# EAGLE schematic snc98_Display_15x7-Seg_1-digit_SC39 (EAGLE 6.6.0)

## Sheet 1 of 2
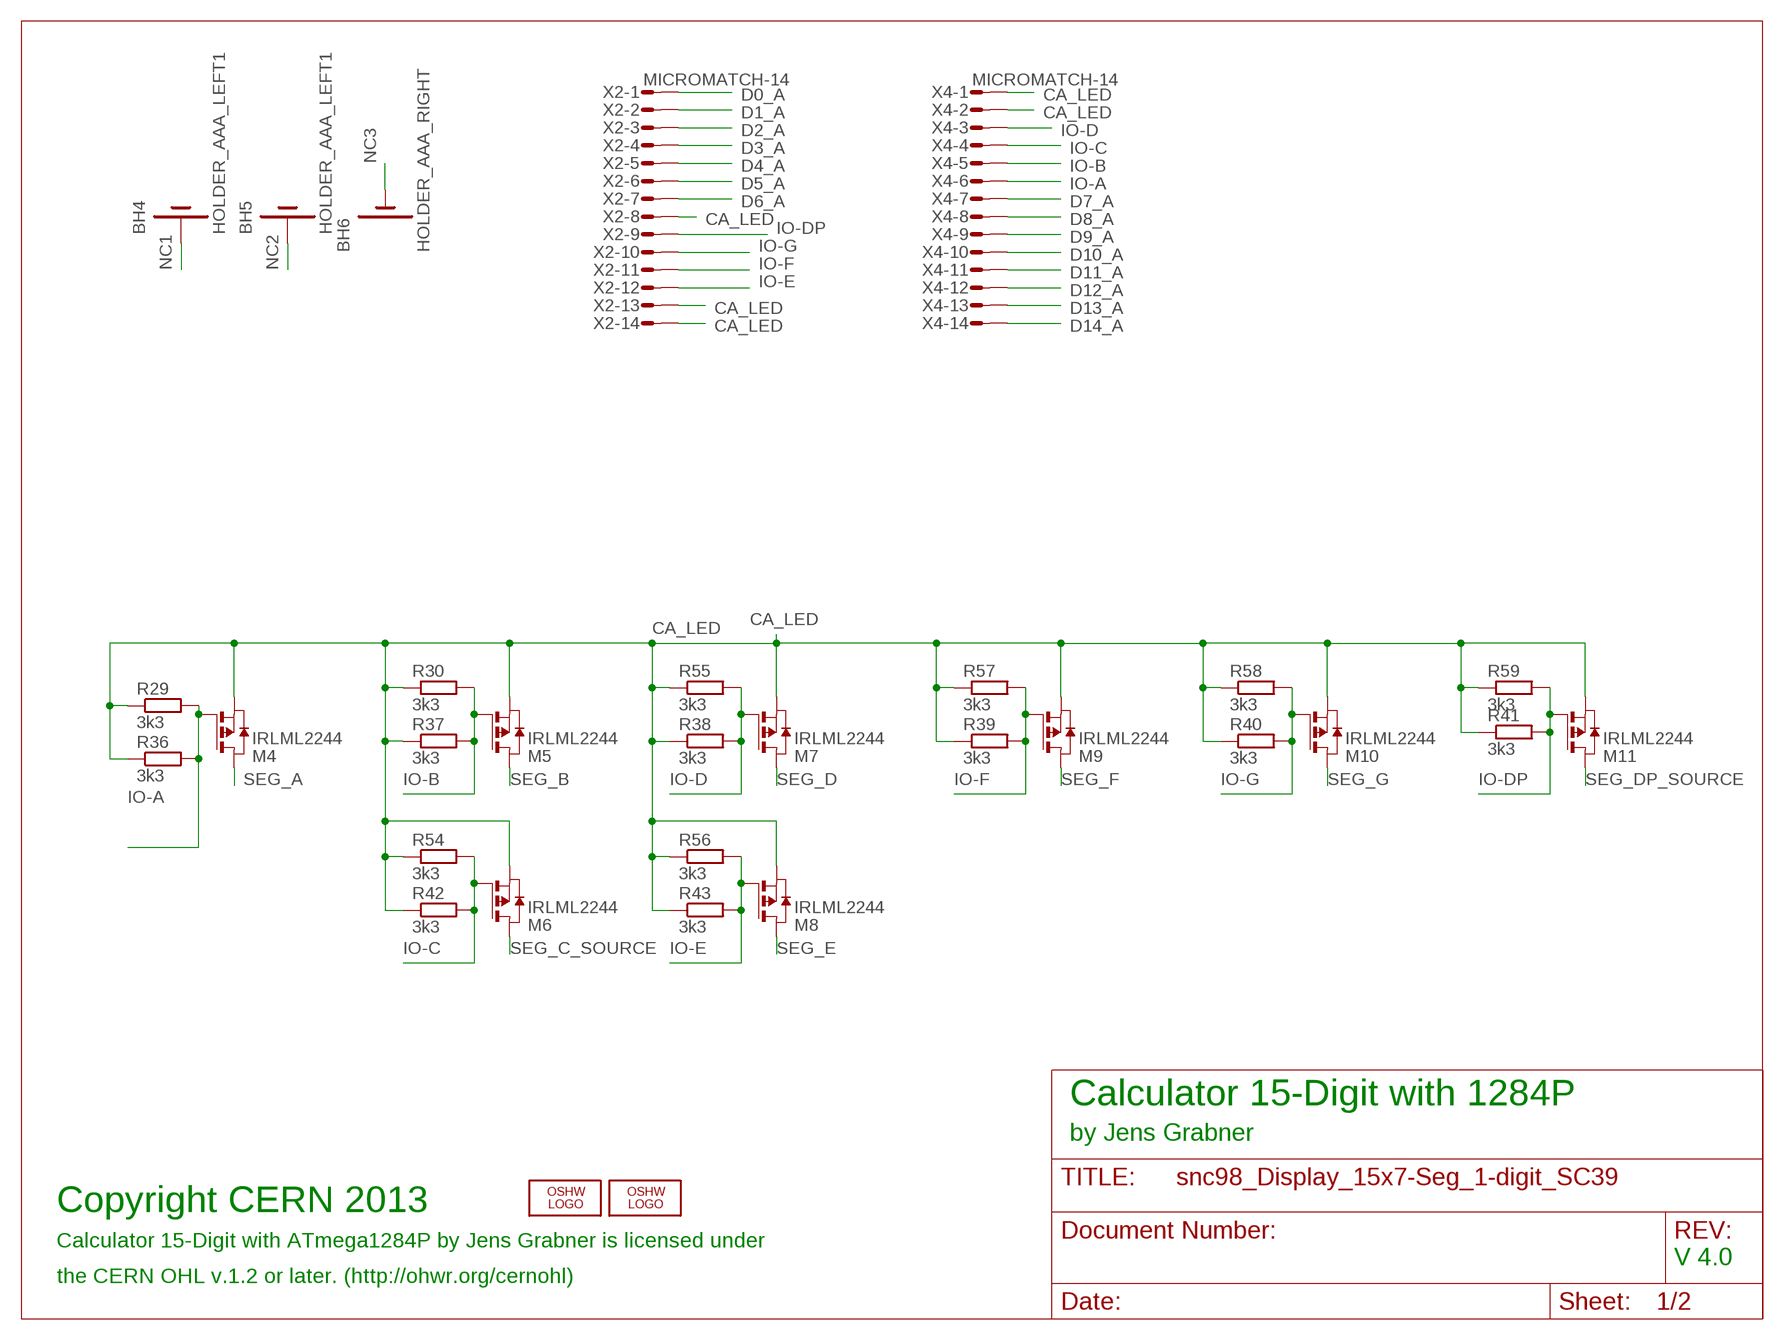
[diagram p0: schematic, sheet 1]

### Parts
BH4  HOLDER_AAA_LEFT1  [BATTERY-AAA-LEFT]
BH5  HOLDER_AAA_LEFT1  [BATTERY-AAA-LEFT]
BH6  HOLDER_AAA_RIGHT  [BATTERY-AAA-RIGHT]
LOGO1  OSHW_LOGO_8MILX0150-NT  [OSHW_8X150_NOTEXT]
LOGO3  OSHW_LOGO_6MILX0100-NT  [OSHW_6X100_NOTEXT]
M4  IRLML2244  IRLML6402  [SOT-23]
M5  IRLML2244  IRLML6402  [SOT-23]
M6  IRLML2244  IRLML6402  [SOT-23]
M7  IRLML2244  IRLML6402  [SOT-23]
M8  IRLML2244  IRLML6402  [SOT-23]
M9  IRLML2244  IRLML6402  [SOT-23]
M10  IRLML2244  IRLML6402  [SOT-23]
M11  IRLML2244  IRLML6402  [SOT-23]
R29  3k3  R-EU_0204/5  [0204/5]
R30  3k3  R-EU_0204/5  [0204/5]
R36  3k3  R-EU_R1206  [R1206]
R37  3k3  R-EU_R1206  [R1206]
R38  3k3  R-EU_R1206  [R1206]
R39  3k3  R-EU_R1206  [R1206]
R40  3k3  R-EU_R1206  [R1206]
R41  3k3  R-EU_R1206  [R1206]
R42  3k3  R-EU_R1206  [R1206]
R43  3k3  R-EU_R1206  [R1206]
R54  3k3  R-EU_0204/5  [0204/5]
R55  3k3  R-EU_0204/5  [0204/5]
R56  3k3  R-EU_0204/5  [0204/5]
R57  3k3  R-EU_0204/5  [0204/5]
R58  3k3  R-EU_0204/5  [0204/5]
R59  3k3  R-EU_0204/5  [0204/5]
X2  MICROMATCH-14  [MICROMATCH-14]
X4  MICROMATCH-14  [MICROMATCH-14]

### Nets
CA_LED: M4.2(S) M5.2(S) M6.2(S) M7.2(S) M8.2(S) M9.2(S) M10.2(S) M11.2(S) R29.1 R30.1 R36.1 R37.1 R38.1 R39.1 R40.1 R41.1 R42.1 R43.1 R54.1 R55.1 R56.1 R57.1 R58.1 R59.1 X2.8 X2.13 X2.14 X4.1 X4.2 ; also sheet 2
D0_A: X2.1 ; also sheet 2
D1_A: X2.2 ; also sheet 2
D2_A: X2.3 ; also sheet 2
D3_A: X2.4 ; also sheet 2
D4_A: X2.5 ; also sheet 2
D5_A: X2.6 ; also sheet 2
D6_A: X2.7 ; also sheet 2
D7_A: X4.7 ; also sheet 2
D8_A: X4.8 ; also sheet 2
D9_A: X4.9 ; also sheet 2
D10_A: X4.10 ; also sheet 2
D11_A: X4.11 ; also sheet 2
D12_A: X4.12 ; also sheet 2
D13_A: X4.13 ; also sheet 2
D14_A: X4.14 ; also sheet 2
IO-A: M4.1(G) R29.2 R36.2 X4.6 ; also sheet 2
IO-B: M5.1(G) R30.2 R37.2 X4.5 ; also sheet 2
IO-C: M6.1(G) R42.2 R54.2 X4.4 ; also sheet 2
IO-D: M7.1(G) R38.2 R55.2 X4.3 ; also sheet 2
IO-DP: M11.1(G) R41.2 R59.2 X2.9 ; also sheet 2
IO-E: M8.1(G) R43.2 R56.2 X2.12 ; also sheet 2
IO-F: M9.1(G) R39.2 R57.2 X2.11 ; also sheet 2
IO-G: M10.1(G) R40.2 R58.2 X2.10 ; also sheet 2
NC1: BH4.P1(+) BH4.P2(+) BH4.P3(+) BH4.P4(+)
NC2: BH5.P1(+) BH5.P2(+) BH5.P3(+) BH5.P4(+)
NC3: BH6.M1(-) BH6.M2(-) BH6.M3(-) BH6.M4(-)
SEG_A: M4.3(D) ; also sheet 2
SEG_B: M5.3(D) ; also sheet 2
SEG_C_SOURCE: M6.3(D) ; also sheet 2
SEG_D: M7.3(D) ; also sheet 2
SEG_DP_SOURCE: M11.3(D) ; also sheet 2
SEG_E: M8.3(D) ; also sheet 2
SEG_F: M9.3(D) ; also sheet 2
SEG_G: M10.3(D) ; also sheet 2

### Notes on the sheet
- Calculator 15-Digit with 1284P
- by Jens Grabner
- Copyright CERN 2013
- Calculator 15-Digit with ATmega1284P by Jens Grabner is licensed under
- V 4.0
- the CERN OHL v.1.2 or later. (http://ohwr.org/cernohl)

## Sheet 2 of 2
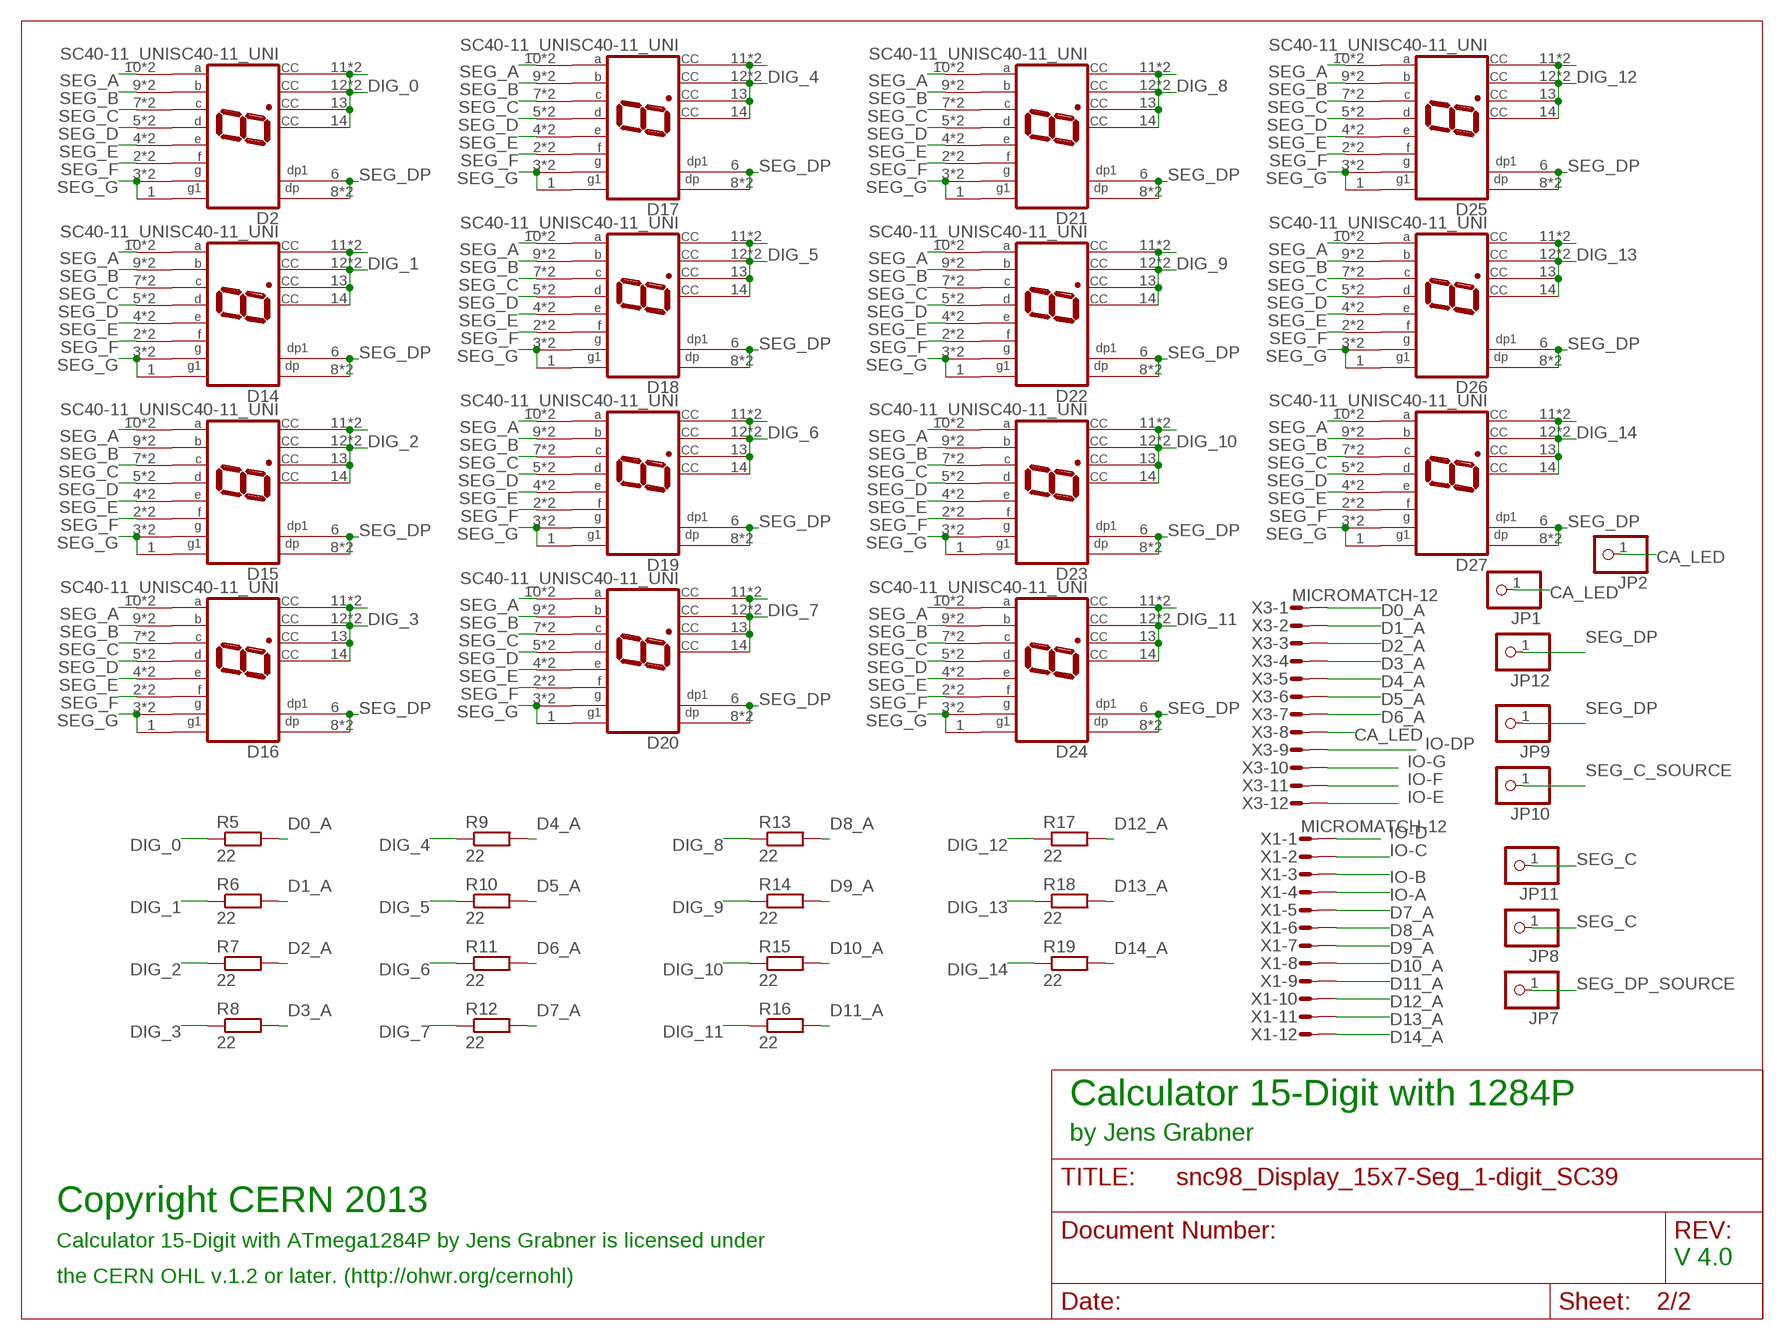
[diagram p1: schematic, sheet 2]

### Parts
D2  SC40-11_UNISC40-11_UNI  [10MM_UNI]
D14  SC40-11_UNISC40-11_UNI  [10MM_UNI]
D15  SC40-11_UNISC40-11_UNI  [10MM_UNI]
D16  SC40-11_UNISC40-11_UNI  [10MM_UNI]
D17  SC40-11_UNISC40-11_UNI  [10MM_UNI]
D18  SC40-11_UNISC40-11_UNI  [10MM_UNI]
D19  SC40-11_UNISC40-11_UNI  [10MM_UNI]
D20  SC40-11_UNISC40-11_UNI  [10MM_UNI]
D21  SC40-11_UNISC40-11_UNI  [10MM_UNI]
D22  SC40-11_UNISC40-11_UNI  [10MM_UNI]
D23  SC40-11_UNISC40-11_UNI  [10MM_UNI]
D24  SC40-11_UNISC40-11_UNI  [10MM_UNI]
D25  SC40-11_UNISC40-11_UNI  [10MM_UNI]
D26  SC40-11_UNISC40-11_UNI  [10MM_UNI]
D27  SC40-11_UNISC40-11_UNI  [10MM_UNI]
JP1  PINHD-1X1  [1X01]
JP2  PINHD-1X1  [1X01]
JP7  PINHD-1X1  [1X01]
JP8  PINHD-1X1  [1X01]
JP9  PINHD-1X1  [1X01]
JP10  PINHD-1X1  [1X01]
JP11  PINHD-1X1  [1X01]
JP12  PINHD-1X1  [1X01]
R5  22  R-EU_R1210  [R1210]
R6  22  R-EU_R1210  [R1210]
R7  22  R-EU_R1210  [R1210]
R8  22  R-EU_R1210  [R1210]
R9  22  R-EU_R1210  [R1210]
R10  22  R-EU_R1210  [R1210]
R11  22  R-EU_R1210  [R1210]
R12  22  R-EU_R1210  [R1210]
R13  22  R-EU_R1210  [R1210]
R14  22  R-EU_R1210  [R1210]
R15  22  R-EU_R1210  [R1210]
R16  22  R-EU_R1210  [R1210]
R17  22  R-EU_R1210  [R1210]
R18  22  R-EU_R1210  [R1210]
R19  22  R-EU_R1210  [R1210]
X1  MICROMATCH-12  [MICROMATCH-12]
X3  MICROMATCH-12  [MICROMATCH-12]

### Nets
CA_LED: JP1.1 JP2.1 X3.8 ; also sheet 1
D0_A: R5.2 X3.1 ; also sheet 1
D1_A: R6.2 X3.2 ; also sheet 1
D2_A: R7.2 X3.3 ; also sheet 1
D3_A: R8.2 X3.4 ; also sheet 1
D4_A: R9.2 X3.5 ; also sheet 1
D5_A: R10.2 X3.6 ; also sheet 1
D6_A: R11.2 X3.7 ; also sheet 1
D7_A: R12.2 X1.5 ; also sheet 1
D8_A: R13.2 X1.6 ; also sheet 1
D9_A: R14.2 X1.7 ; also sheet 1
D10_A: R15.2 X1.8 ; also sheet 1
D11_A: R16.2 X1.9 ; also sheet 1
D12_A: R17.2 X1.10 ; also sheet 1
D13_A: R18.2 X1.11 ; also sheet 1
D14_A: R19.2 X1.12 ; also sheet 1
DIG_0: D2.11(CC1) D2.12(CC2) D2.13(CC3) D2.14(CC4) D2.23(CC1) D2.28(CC2) R5.1
DIG_1: D14.11(CC1) D14.12(CC2) D14.13(CC3) D14.14(CC4) D14.23(CC1) D14.28(CC2) R6.1
DIG_2: D15.11(CC1) D15.12(CC2) D15.13(CC3) D15.14(CC4) D15.23(CC1) D15.28(CC2) R7.1
DIG_3: D16.11(CC1) D16.12(CC2) D16.13(CC3) D16.14(CC4) D16.23(CC1) D16.28(CC2) R8.1
DIG_4: D17.11(CC1) D17.12(CC2) D17.13(CC3) D17.14(CC4) D17.23(CC1) D17.28(CC2) R9.1
DIG_5: D18.11(CC1) D18.12(CC2) D18.13(CC3) D18.14(CC4) D18.23(CC1) D18.28(CC2) R10.1
DIG_6: D19.11(CC1) D19.12(CC2) D19.13(CC3) D19.14(CC4) D19.23(CC1) D19.28(CC2) R11.1
DIG_7: D20.11(CC1) D20.12(CC2) D20.13(CC3) D20.14(CC4) D20.23(CC1) D20.28(CC2) R12.1
DIG_8: D21.11(CC1) D21.12(CC2) D21.13(CC3) D21.14(CC4) D21.23(CC1) D21.28(CC2) R13.1
DIG_9: D22.11(CC1) D22.12(CC2) D22.13(CC3) D22.14(CC4) D22.23(CC1) D22.28(CC2) R14.1
DIG_10: D23.11(CC1) D23.12(CC2) D23.13(CC3) D23.14(CC4) D23.23(CC1) D23.28(CC2) R15.1
DIG_11: D24.11(CC1) D24.12(CC2) D24.13(CC3) D24.14(CC4) D24.23(CC1) D24.28(CC2) R16.1
DIG_12: D25.11(CC1) D25.12(CC2) D25.13(CC3) D25.14(CC4) D25.23(CC1) D25.28(CC2) R17.1
DIG_13: D26.11(CC1) D26.12(CC2) D26.13(CC3) D26.14(CC4) D26.23(CC1) D26.28(CC2) R18.1
DIG_14: D27.11(CC1) D27.12(CC2) D27.13(CC3) D27.14(CC4) D27.23(CC1) D27.28(CC2) R19.1
IO-A: X1.4 ; also sheet 1
IO-B: X1.3 ; also sheet 1
IO-C: X1.2 ; also sheet 1
IO-D: X1.1 ; also sheet 1
IO-DP: X3.9 ; also sheet 1
IO-E: X3.12 ; also sheet 1
IO-F: X3.11 ; also sheet 1
IO-G: X3.10 ; also sheet 1
SEG_A: D2.10(A) D2.27(A) D14.10(A) D14.27(A) D15.10(A) D15.27(A) D16.10(A) D16.27(A) D17.10(A) D17.27(A) D18.10(A) D18.27(A) D19.10(A) D19.27(A) D20.10(A) D20.27(A) D21.10(A) D21.27(A) D22.10(A) D22.27(A) D23.10(A) D23.27(A) D24.10(A) D24.27(A) D25.10(A) D25.27(A) D26.10(A) D26.27(A) D27.10(A) D27.27(A) ; also sheet 1
SEG_B: D2.9(B) D2.26(B) D14.9(B) D14.26(B) D15.9(B) D15.26(B) D16.9(B) D16.26(B) D17.9(B) D17.26(B) D18.9(B) D18.26(B) D19.9(B) D19.26(B) D20.9(B) D20.26(B) D21.9(B) D21.26(B) D22.9(B) D22.26(B) D23.9(B) D23.26(B) D24.9(B) D24.26(B) D25.9(B) D25.26(B) D26.9(B) D26.26(B) D27.9(B) D27.26(B) ; also sheet 1
SEG_C: D2.7(C) D2.24(C) D14.7(C) D14.24(C) D15.7(C) D15.24(C) D16.7(C) D16.24(C) D17.7(C) D17.24(C) D18.7(C) D18.24(C) D19.7(C) D19.24(C) D20.7(C) D20.24(C) D21.7(C) D21.24(C) D22.7(C) D22.24(C) D23.7(C) D23.24(C) D24.7(C) D24.24(C) D25.7(C) D25.24(C) D26.7(C) D26.24(C) D27.7(C) D27.24(C) JP8.1 JP11.1
SEG_C_SOURCE: JP10.1 ; also sheet 1
SEG_D: D2.5(D) D2.22(D) D14.5(D) D14.22(D) D15.5(D) D15.22(D) D16.5(D) D16.22(D) D17.5(D) D17.22(D) D18.5(D) D18.22(D) D19.5(D) D19.22(D) D20.5(D) D20.22(D) D21.5(D) D21.22(D) D22.5(D) D22.22(D) D23.5(D) D23.22(D) D24.5(D) D24.22(D) D25.5(D) D25.22(D) D26.5(D) D26.22(D) D27.5(D) D27.22(D) ; also sheet 1
SEG_DP: D2.6(DP1) D2.8(DP) D2.25(DP) D14.6(DP1) D14.8(DP) D14.25(DP) D15.6(DP1) D15.8(DP) D15.25(DP) D16.6(DP1) D16.8(DP) D16.25(DP) D17.6(DP1) D17.8(DP) D17.25(DP) D18.6(DP1) D18.8(DP) D18.25(DP) D19.6(DP1) D19.8(DP) D19.25(DP) D20.6(DP1) D20.8(DP) D20.25(DP) D21.6(DP1) D21.8(DP) D21.25(DP) D22.6(DP1) D22.8(DP) D22.25(DP) D23.6(DP1) D23.8(DP) D23.25(DP) D24.6(DP1) D24.8(DP) D24.25(DP) D25.6(DP1) D25.8(DP) D25.25(DP) D26.6(DP1) D26.8(DP) D26.25(DP) D27.6(DP1) D27.8(DP) D27.25(DP) JP9.1 JP12.1
SEG_DP_SOURCE: JP7.1 ; also sheet 1
SEG_E: D2.4(E) D2.21(E) D14.4(E) D14.21(E) D15.4(E) D15.21(E) D16.4(E) D16.21(E) D17.4(E) D17.21(E) D18.4(E) D18.21(E) D19.4(E) D19.21(E) D20.4(E) D20.21(E) D21.4(E) D21.21(E) D22.4(E) D22.21(E) D23.4(E) D23.21(E) D24.4(E) D24.21(E) D25.4(E) D25.21(E) D26.4(E) D26.21(E) D27.4(E) D27.21(E) ; also sheet 1
SEG_F: D2.2(F) D2.29(F) D14.2(F) D14.29(F) D15.2(F) D15.29(F) D16.2(F) D16.29(F) D17.2(F) D17.29(F) D18.2(F) D18.29(F) D19.2(F) D19.29(F) D20.2(F) D20.29(F) D21.2(F) D21.29(F) D22.2(F) D22.29(F) D23.2(F) D23.29(F) D24.2(F) D24.29(F) D25.2(F) D25.29(F) D26.2(F) D26.29(F) D27.2(F) D27.29(F) ; also sheet 1
SEG_G: D2.1(G1) D2.3(G) D2.30(G) D14.1(G1) D14.3(G) D14.30(G) D15.1(G1) D15.3(G) D15.30(G) D16.1(G1) D16.3(G) D16.30(G) D17.1(G1) D17.3(G) D17.30(G) D18.1(G1) D18.3(G) D18.30(G) D19.1(G1) D19.3(G) D19.30(G) D20.1(G1) D20.3(G) D20.30(G) D21.1(G1) D21.3(G) D21.30(G) D22.1(G1) D22.3(G) D22.30(G) D23.1(G1) D23.3(G) D23.30(G) D24.1(G1) D24.3(G) D24.30(G) D25.1(G1) D25.3(G) D25.30(G) D26.1(G1) D26.3(G) D26.30(G) D27.1(G1) D27.3(G) D27.30(G) ; also sheet 1

### Notes on the sheet
- Calculator 15-Digit with 1284P
- by Jens Grabner
- Copyright CERN 2013
- Calculator 15-Digit with ATmega1284P by Jens Grabner is licensed under
- V 4.0
- the CERN OHL v.1.2 or later. (http://ohwr.org/cernohl)

## Library data of the parts
BH4 BH5 = SparkFun-Electromechanical:HOLDER_AAA_LEFT
BH6 = SparkFun-Electromechanical:HOLDER_AAA_RIGHT
D2 D14-D27 = display-hp:SC40-11_UNI: SC40-11_UNI
JP1 JP2 JP7-JP12 = adafruit:PINHD-1X1: Pin header 1x1 for 0.1" spacing With round pins
LOGO1 = ohw-logo:OSHW_LOGO_8MIL
LOGO3 = ohw-logo:OSHW_LOGO_6MIL
M4-M11 = IRLML6402:IRLML6402
R5-R19 R29 R30 R36-R43 R54-R59 = rcl:R-EU_: RESISTOR, European symbol
X1 X3 = Con-amp-micromatch:MICROMATCH-12: MicroMaTch 12 8-215464-2 / 1-215464-2 Drawing Number C-215464 DDEController.pdf; MF: FARNELL; MPN: 8-215464-2; OC_FARNELL: 3784666; OC_NEWARK: 95H9857
X2 X4 = Con-amp-micromatch:MICROMATCH-14: MicroMaTch 14 8-215464-4 / 1-215464-4 Drawing Number C-215464 DDEController.pdf; MF: FARNELL; MPN: 8-215464-4; OC_FARNELL: 3784678; OC_NEWARK: 19J6431